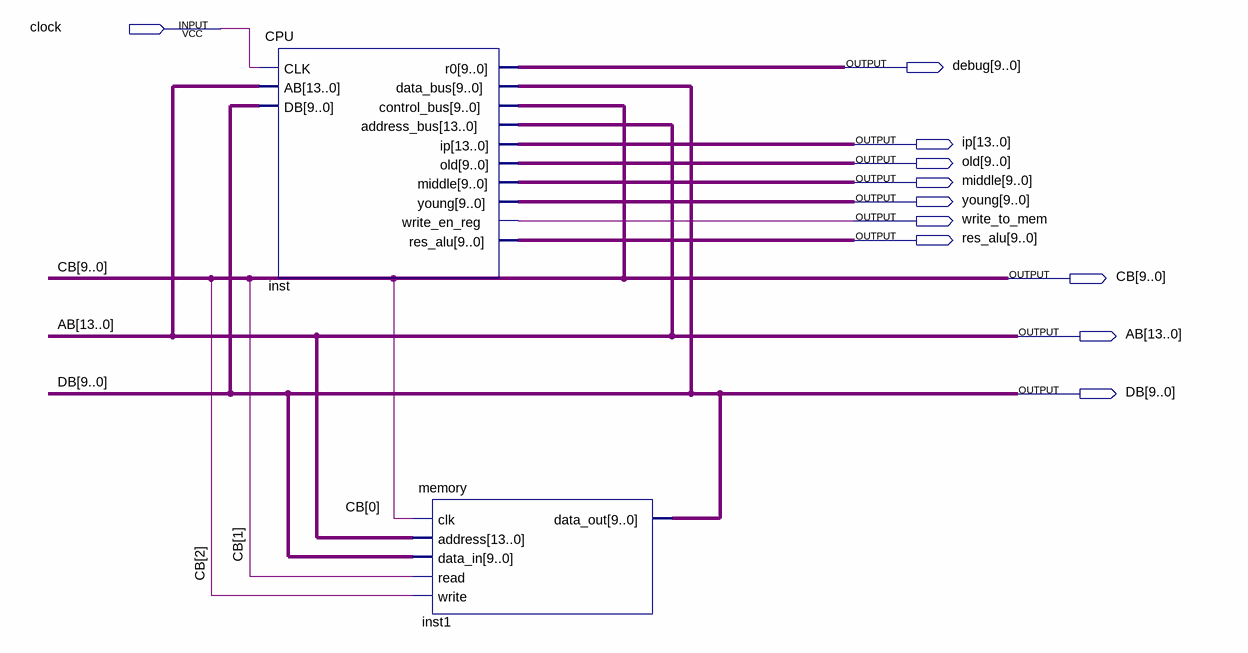
[diagram p0: schematic sheet]
// Quartus schematic main.bdf as structural Verilog: 2 symbols, 11 pins
module main (
  input  clock,
  output [9:0] debug,
  output [13:0] ip,
  output [9:0] old,
  output [9:0] middle,
  output [9:0] young,
  output write_to_mem,
  output [9:0] res_alu,
  output [9:0] CB,
  output [13:0] AB,
  output [9:0] DB
);

  CPU inst (
    .CLK(clock), .AB(AB), .DB(DB), .r0(debug), .data_bus(DB), .control_bus(CB), .address_bus(AB), .ip(ip),
    .old(old), .middle(middle), .young(young), .write_en_reg(write_to_mem), .res_alu(res_alu));
  memory inst1 (.clk(CB[0]), .address(AB), .data_in(DB), .read(CB[1]), .write(CB[2]), .data_out(DB));
endmodule
